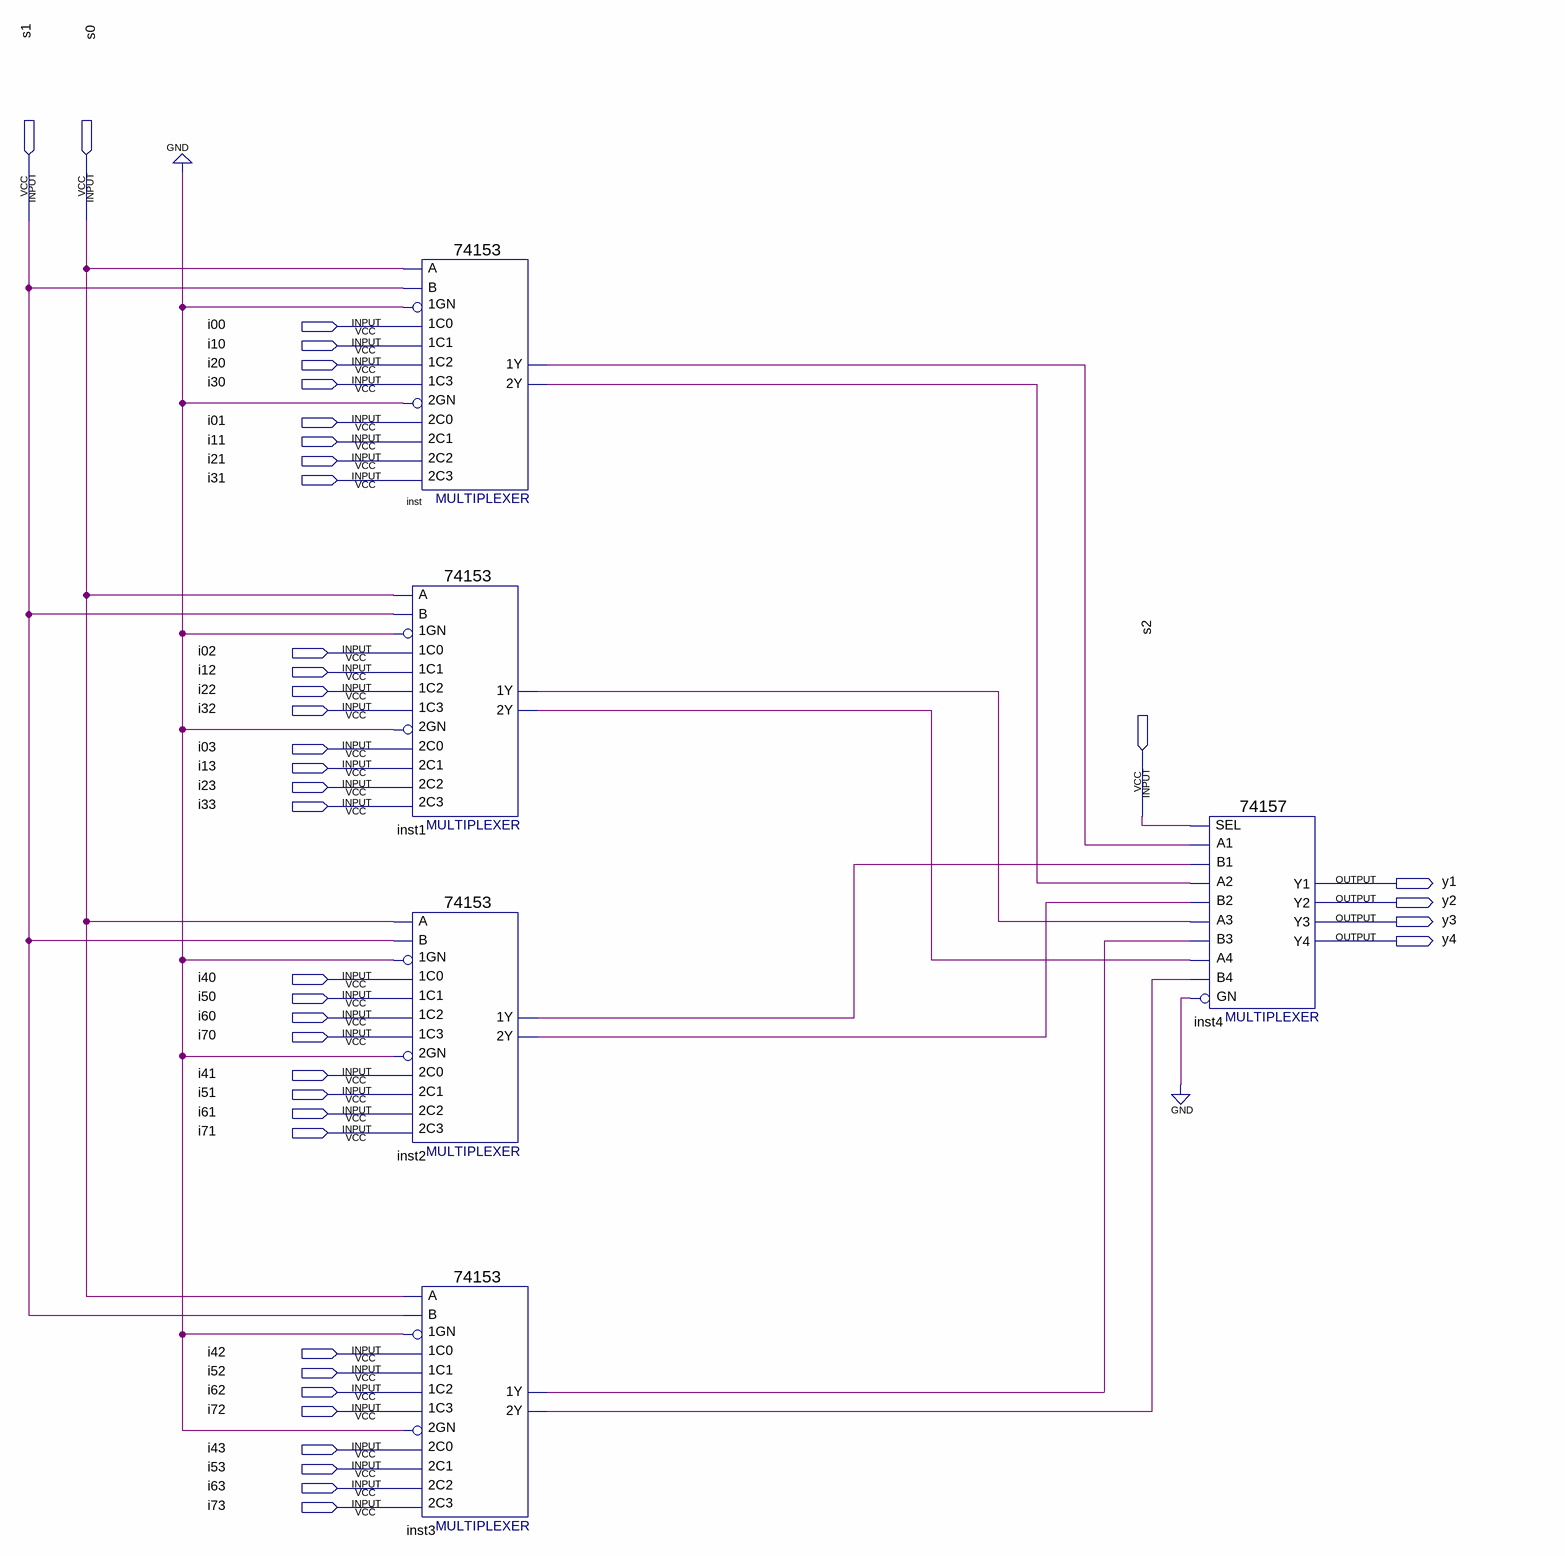
[diagram p0: schematic sheet]
// Quartus schematic Multiplexers.bdf as structural Verilog: 5 symbols, 39 pins
module Multiplexers (
  input  s1,
  input  s0,
  input  i00,
  input  i10,
  input  i20,
  input  i30,
  input  i01,
  input  i11,
  input  i21,
  input  i31,
  input  i02,
  input  i12,
  input  i22,
  input  i32,
  input  i03,
  input  i13,
  input  i23,
  input  i33,
  input  s2,
  input  i40,
  input  i50,
  input  i60,
  input  i70,
  input  i41,
  input  i51,
  input  i61,
  input  i71,
  input  i42,
  input  i52,
  input  i62,
  input  i72,
  input  i43,
  input  i53,
  input  i63,
  input  i73,
  output y1,
  output y2,
  output y3,
  output y4
);

  wire inst1_1y, inst1_2y, inst2_1y, inst2_2y, inst3_1y, inst3_2y, inst_1y, inst_2y;

  \74153  inst (
    .\1C1 (i10), .\1GN (1'b0), .\1C0 (i00), .\2C0 (i01), .\2GN (1'b0), .\2C2 (i21), .\1C2 (i20), .\1C3 (i30),
    .B(s1), .A(s0), .\2C1 (i11), .\2C3 (i31), .\1Y (inst_1y), .\2Y (inst_2y));
  \74153  inst1 (
    .\1C1 (i12), .\1GN (1'b0), .\1C0 (i02), .\2C0 (i03), .\2GN (1'b0), .\2C2 (i23), .\1C2 (i22), .\1C3 (i32),
    .B(s1), .A(s0), .\2C1 (i13), .\2C3 (i33), .\1Y (inst1_1y), .\2Y (inst1_2y));
  \74153  inst2 (
    .\1C1 (i50), .\1GN (1'b0), .\1C0 (i40), .\2C0 (i41), .\2GN (1'b0), .\2C2 (i61), .\1C2 (i60), .\1C3 (i70),
    .B(s1), .A(s0), .\2C1 (i51), .\2C3 (i71), .\1Y (inst2_1y), .\2Y (inst2_2y));
  \74153  inst3 (
    .\1C1 (i52), .\1GN (1'b0), .\1C0 (i42), .\2C0 (i43), .\2GN (1'b0), .\2C2 (i63), .\1C2 (i62), .\1C3 (i72),
    .B(s1), .A(s0), .\2C1 (i53), .\2C3 (i73), .\1Y (inst3_1y), .\2Y (inst3_2y));
  \74157  inst4 (
    .A1(inst_1y), .B1(inst2_1y), .SEL(s2), .B2(inst2_2y), .A3(inst1_1y), .B3(inst3_1y), .A2(inst_2y),
    .B4(inst3_2y), .GN(1'b0), .A4(inst1_2y), .Y2(y2), .Y1(y1), .Y4(y4), .Y3(y3));
endmodule
